# Altium schematic sheet Driver.SchDoc
size A4
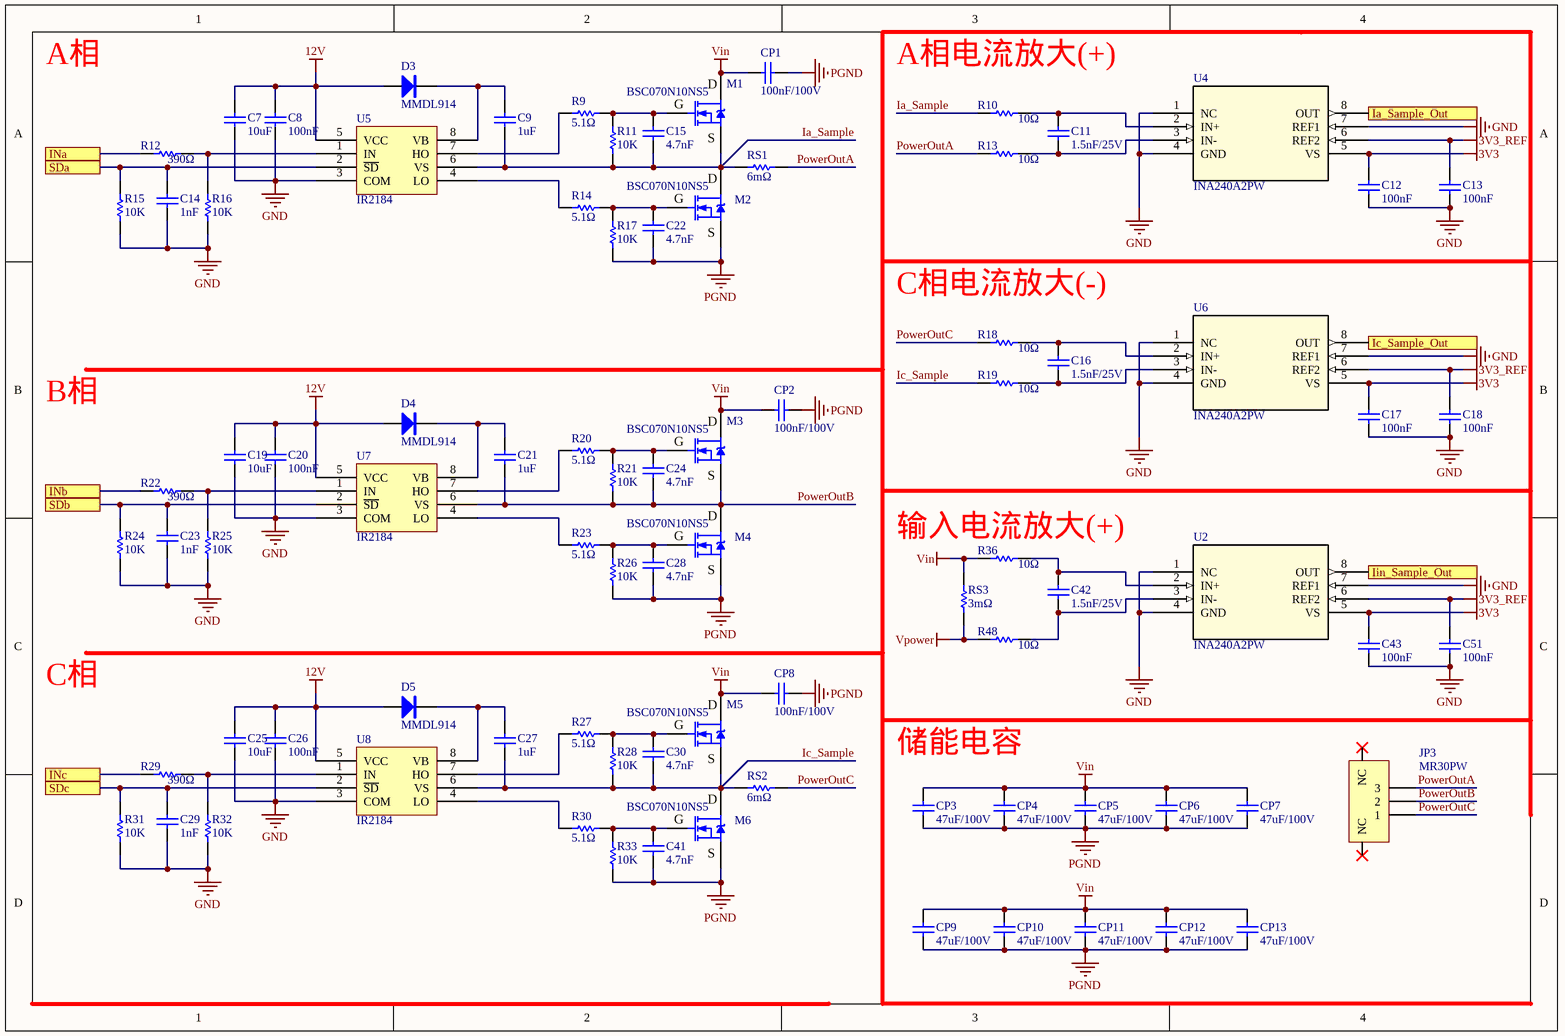
[diagram p0: Driver.SchDoc]

## Parts
C7  10uF  [C0805]
C8  100nF  [C0603]
C9  1uF  [C0805]
C11  1.5nF/25V  [C0402]
C12  100nF  [C0402]
C13  100nF  [C0402]
C14  1nF  [C0603]
C15  4.7nF  [C0603]
C16  1.5nF/25V  [C0402]
C17  100nF  [C0402]
C18  100nF  [C0402]
C19  10uF  [C0805]
C20  100nF  [C0603]
C21  1uF  [C0805]
C22  4.7nF  [C0603]
C23  1nF  [C0603]
C24  4.7nF  [C0603]
C25  10uF  [C0805]
C26  100nF  [C0603]
C27  1uF  [C0805]
C28  4.7nF  [C0603]
C29  1nF  [C0603]
C30  4.7nF  [C0603]
C41  4.7nF  [C0603]
C42  1.5nF/25V  [C0402]
C43  100nF  [C0402]
C51  100nF  [C0402]
CP1  100nF/100V  [C0603]
CP2  100nF/100V  [C0603]
CP3  47uF/100V  [C1206]
CP4  47uF/100V  [C1206]
CP5  47uF/100V  [C1206]
CP6  47uF/100V  [C1206]
CP7  47uF/100V  [C1206]
CP8  100nF/100V  [C0603]
CP9  47uF/100V  [C1206]
CP10  47uF/100V  [C1206]
CP11  47uF/100V  [C1206]
CP12  47uF/100V  [C1206]
CP13  47uF/100V  [C1206]
D3  MMDL914  [SOD-323]
D4  MMDL914  [SOD-323]
D5  MMDL914  [SOD-323]
JP3  MR30PW  [MR30PW-FB]
M1  BSC070N10NS5  [TDSON-8]
M2  BSC070N10NS5  [TDSON-8]
M3  BSC070N10NS5  [TDSON-8]
M4  BSC070N10NS5  [TDSON-8]
M5  BSC070N10NS5  [TDSON-8]
M6  BSC070N10NS5  [TDSON-8]
R9  5.1Ω  [R0603]
R10  10Ω  [R0402]
R11  10K  [R0603]
R12  390Ω  [R0603]
R13  10Ω  [R0402]
R14  5.1Ω  [R0603]
R15  10K  [R0603]
R16  10K  [R0603]
R17  10K  [R0603]
R18  10Ω  [R0402]
R19  10Ω  [R0402]
R20  5.1Ω  [R0603]
R21  10K  [R0603]
R22  390Ω  [R0603]
R23  5.1Ω  [R0603]
R24  10K  [R0603]
R25  10K  [R0603]
R26  10K  [R0603]
R27  5.1Ω  [R0603]
R28  10K  [R0603]
R29  390Ω  [R0603]
R30  5.1Ω  [R0603]
R31  10K  [R0603]
R32  10K  [R0603]
R33  10K  [R0603]
R36  10Ω  [R0402]
R48  10Ω  [R0402]
RS1  6mΩ  [R1206]
RS2  6mΩ  [R1206]
RS3  3mΩ  [R1206]
U2  INA240A2PW  [TSSOP8_L 3*4.4mm]
U4  INA240A2PW  [TSSOP8_L 3*4.4mm]
U5  IR2184  [SOP8_L]
U6  INA240A2PW  [TSSOP8_L 3*4.4mm]
U7  IR2184  [SOP8_L]
U8  IR2184  [SOP8_L]

## Ports
Ia_Sample_Out, Ic_Sample_Out, Iin_Sample_Out, INa, INb, INc, SDa, SDb, SDc

## Nets
3V3: C12.2 C17.2 C43.2 U2.5(VS) U4.5(VS) U6.5(VS)
3V3_REF: C13.2 C18.2 C51.2 U2.6(REF2) U4.6(REF2) U6.6(REF2)
12V: C7.1 C8.1 C19.1 C20.1 C25.1 C26.1 D3.A D4.A D5.A U5.5(VCC) U7.5(VCC) U8.5(VCC)
GND: C7.2 C8.2 C12.1 C13.1 C14.2 C17.1 C18.1 C19.2 C20.2 C23.2 C25.2 C26.2 C29.2 C43.1 C51.1 R15.2 R16.2 R24.2 R25.2 R31.2 R32.2 U2.1(NC) U2.4(GND) U2.7(REF1) U4.1(NC) U4.4(GND) U4.7(REF1) U5.3(COM) U6.1(NC) U6.4(GND) U6.7(REF1) U7.3(COM) U8.3(COM)
PGND: C22.2 C28.2 C41.2 CP1.1 CP2.1 CP3.1 CP4.1 CP5.1 CP6.1 CP7.1 CP8.1 CP9.1 CP10.1 CP11.1 CP12.1 CP13.1 M2.S M4.S M6.S R17.1 R26.1 R33.1
Vin: CP1.2 CP2.2 CP3.2 CP4.2 CP5.2 CP6.2 CP7.2 CP8.2 CP9.2 CP10.2 CP11.2 CP12.2 CP13.2 M1.D M3.D M5.D R36.2 RS3.1
Vpower: R48.2 RS3.2
Ia_Sample: C9.2 C15.2 M1.S M2.D R10.2 R11.1 RS1.2 U5.6(VS)
Ia_Sample_Out: U4.8(OUT) ; port Ia_Sample_Out
Ic_Sample: C27.2 C30.2 M5.S M6.D R19.2 R28.1 RS2.2 U8.6(VS)
Ic_Sample_Out: U6.8(OUT) ; port Ic_Sample_Out
Iin_Sample_Out: U2.8(OUT) ; port Iin_Sample_Out
INa: R12.2 ; port INa
INb: R22.2 ; port INb
INc: R29.2 ; port INc
PowerOutA: JP3.3 R13.2 RS1.1
PowerOutB: C21.2 C24.2 JP3.2 M3.S M4.D R21.1 U7.6(VS)
PowerOutC: JP3.1 R18.2 RS2.1
SDa: C14.1 R15.1 U5.2(~{SD}) ; port SDa
SDb: C23.1 R24.1 U7.2(~{SD}) ; port SDb
SDc: C29.1 R31.1 U8.2(~{SD}) ; port SDc
NetC9_1: C9.1 D3.K U5.8(VB)
NetC11_1: C11.1 R13.1 U4.3(IN-)
NetC11_2: C11.2 R10.1 U4.2(IN+)
NetC15_1: C15.1 M1.G R9.1 R11.2
NetC16_1: C16.1 R19.1 U6.3(IN-)
NetC16_2: C16.2 R18.1 U6.2(IN+)
NetC21_1: C21.1 D4.K U7.8(VB)
NetC22_1: C22.1 M2.G R14.1 R17.2
NetC24_1: C24.1 M3.G R20.1 R21.2
NetC27_1: C27.1 D5.K U8.8(VB)
NetC28_1: C28.1 M4.G R23.1 R26.2
NetC30_1: C30.1 M5.G R27.1 R28.2
NetC41_1: C41.1 M6.G R30.1 R33.2
NetC42_1: C42.1 R48.1 U2.3(IN-)
NetC42_2: C42.2 R36.1 U2.2(IN+)
NetR9_2: R9.2 U5.7(HO)
NetR12_1: R12.1 R16.1 U5.1(IN)
NetR14_2: R14.2 U5.4(LO)
NetR20_2: R20.2 U7.7(HO)
NetR22_1: R22.1 R25.1 U7.1(IN)
NetR23_2: R23.2 U7.4(LO)
NetR27_2: R27.2 U8.7(HO)
NetR29_1: R29.1 R32.1 U8.1(IN)
NetR30_2: R30.2 U8.4(LO)

Not connected (* = marked no-connect by the designer): JP3 4(NC)* 5(NC)*

## Notes on the sheet
- A相
- A相电流放大(+)
- C相电流放大(-)
- B相
- (near R36) 输入电流放大(+)
- C相
- 储能电容

## Library data of the parts
C7-C9 C11-C30 C41-C43 C51 CP1-CP13 = Cap
D3-D5 = MMDL914: 100V 0.2A开关管
M1-M6 = BSC070N10NS5: N沟场效应管
R9-R33 R36 R48 RS1-RS3 = RES
U2 U4 U6 = INA240: No Description Available; Mfr_Name: Texas Instruments; Manufacturer_Part_Number: INA240A1PW; Copyright: Copyright (C) 2022 Ultra Librarian. All rights reserved.; RefDes: RefDes; Type: DEV
U5 U7 U8 = IR2184: 半桥驱动